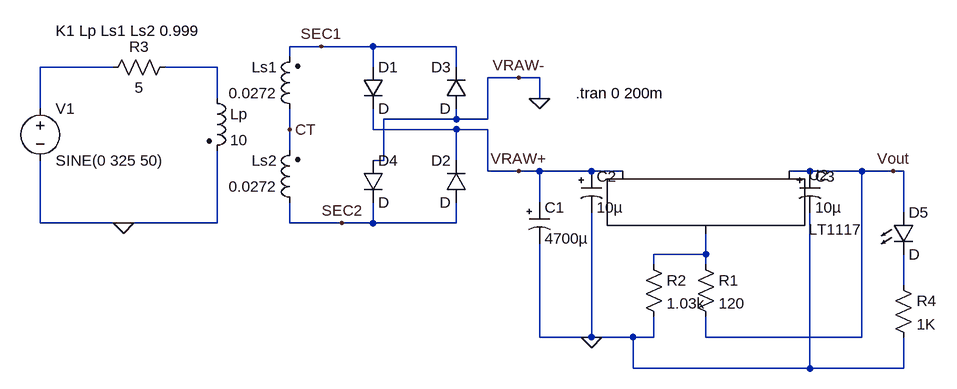
[diagram p0: schematic AC to 12V-DC Power Supply.asc]
AC to 12V-DC Power Supply.asc, the LTspice schematic file:
Version 4
SHEET 1 880 680
WIRE -976 112 -1024 112
WIRE -896 112 -976 112
WIRE -768 112 -896 112
WIRE -1024 128 -1024 112
WIRE -1296 144 -1408 144
WIRE -1136 144 -1216 144
WIRE -896 144 -896 112
WIRE -768 144 -768 112
WIRE -672 160 -720 160
WIRE -640 160 -672 160
WIRE -1136 192 -1136 144
WIRE -640 192 -640 160
WIRE -1408 208 -1408 144
WIRE -768 224 -768 208
WIRE -768 224 -880 224
WIRE -720 224 -720 160
WIRE -720 224 -768 224
WIRE -1024 240 -1024 208
WIRE -896 240 -896 208
WIRE -768 240 -896 240
WIRE -720 240 -768 240
WIRE -1024 272 -1024 240
WIRE -880 288 -880 224
WIRE -880 288 -896 288
WIRE -768 288 -768 240
WIRE -720 304 -720 240
WIRE -672 304 -720 304
WIRE -640 304 -672 304
WIRE -560 304 -640 304
WIRE -512 304 -560 304
WIRE -224 304 -256 304
WIRE -144 304 -224 304
WIRE -96 304 -144 304
WIRE -80 304 -96 304
WIRE -640 352 -640 304
WIRE -80 368 -80 304
WIRE -1408 384 -1408 288
WIRE -1280 384 -1408 384
WIRE -1136 384 -1136 272
WIRE -1136 384 -1280 384
WIRE -1024 384 -1024 352
WIRE -944 384 -1024 384
WIRE -896 384 -896 352
WIRE -896 384 -944 384
WIRE -768 384 -768 352
WIRE -768 384 -896 384
WIRE -384 432 -384 400
WIRE -384 432 -464 432
WIRE -464 448 -464 432
WIRE -384 448 -384 432
WIRE -80 480 -80 432
WIRE -640 560 -640 416
WIRE -560 560 -560 368
WIRE -560 560 -640 560
WIRE -496 560 -560 560
WIRE -464 560 -464 528
WIRE -464 560 -496 560
WIRE -384 560 -384 528
WIRE -144 560 -144 304
WIRE -144 560 -384 560
WIRE -496 608 -496 560
WIRE -224 608 -224 368
WIRE -224 608 -496 608
WIRE -80 608 -80 560
WIRE -80 608 -224 608
FLAG -1280 384 0
FLAG -976 112 SEC1
FLAG -944 384 SEC2
FLAG -1024 240 CT
FLAG -672 160 VRAW-
FLAG -672 304 VRAW+
FLAG -640 192 0
FLAG -560 560 0
FLAG -96 304 Vout
SYMBOL voltage -1408 192 R0
WINDOW 123 0 0 Left 0
WINDOW 39 0 0 Left 0
SYMATTR InstName V1
SYMATTR Value SINE(0 325 50)
SYMBOL ind2 -1152 176 R0
SYMATTR InstName Lp
SYMATTR Value 10
SYMATTR Type ind
SYMBOL ind2 -1008 224 R180
WINDOW 0 36 80 Left 2
WINDOW 3 36 40 Left 2
SYMATTR InstName Ls1
SYMATTR Value 0.0272
SYMATTR Type ind
SYMBOL ind2 -1008 368 R180
WINDOW 0 36 80 Left 2
WINDOW 3 36 40 Left 2
SYMATTR InstName Ls2
SYMATTR Value 0.0272
SYMATTR Type ind
SYMBOL diode -912 144 R0
SYMATTR InstName D1
SYMBOL diode -752 352 R180
WINDOW 0 24 64 Left 2
WINDOW 3 24 0 Left 2
SYMATTR InstName D2
SYMBOL diode -752 208 R180
WINDOW 0 24 64 Left 2
WINDOW 3 24 0 Left 2
SYMATTR InstName D3
SYMBOL diode -912 288 R0
SYMATTR InstName D4
SYMBOL polcap -656 352 R0
SYMATTR InstName C1
SYMATTR Value 4700µ
SYMBOL PowerProducts\\LT1117 -384 304 R0
SYMATTR InstName U2
SYMBOL res -400 432 R0
SYMATTR InstName R1
SYMATTR Value 120
SYMBOL res -480 432 R0
SYMATTR InstName R2
SYMATTR Value 1.03k
SYMBOL polcap -576 304 R0
SYMATTR InstName C2
SYMATTR Value 10µ
SYMBOL polcap -240 304 R0
SYMATTR InstName C3
SYMATTR Value 10µ
SYMBOL res -1200 128 R90
WINDOW 0 0 56 VBottom 2
WINDOW 3 32 56 VTop 2
SYMATTR InstName R3
SYMATTR Value 5
SYMBOL LED -96 368 R0
SYMATTR InstName D5
SYMBOL res -96 464 R0
SYMATTR InstName R4
SYMATTR Value 1K
TEXT -1384 88 Left 2 !K1 Lp Ls1 Ls2 0.999
TEXT -584 184 Left 2 !.tran 0 200m

The netlist it stands for:
* AC to 12V-DC Power Supply.asc
V1 N001 0 SINE(0 325 50)
Lp N002 0 10
Ls1 CT SEC1 0.0272
Ls2 SEC2 CT 0.0272
D1 SEC1 VRAW+ D
D2 SEC2 VRAW+ D
D3 0 SEC1 D
D4 0 SEC2 D
C1 VRAW+ 0 4700µ
XU2 N003 Vout VRAW+ LT1117
R1 N003 Vout 120
R2 N003 0 1.03k
C2 VRAW+ 0 10µ
C3 Vout 0 10µ
R3 N002 N001 5
D5 Vout N004 D
R4 N004 0 1K
.model D D
.lib standard.dio
K1 Lp Ls1 Ls2 0.999
.tran 0 200m
.lib LT1117.lib
.backanno
.end